# Altium schematic sheet 02. ZIGBEE CC2530.SchDoc
size A4
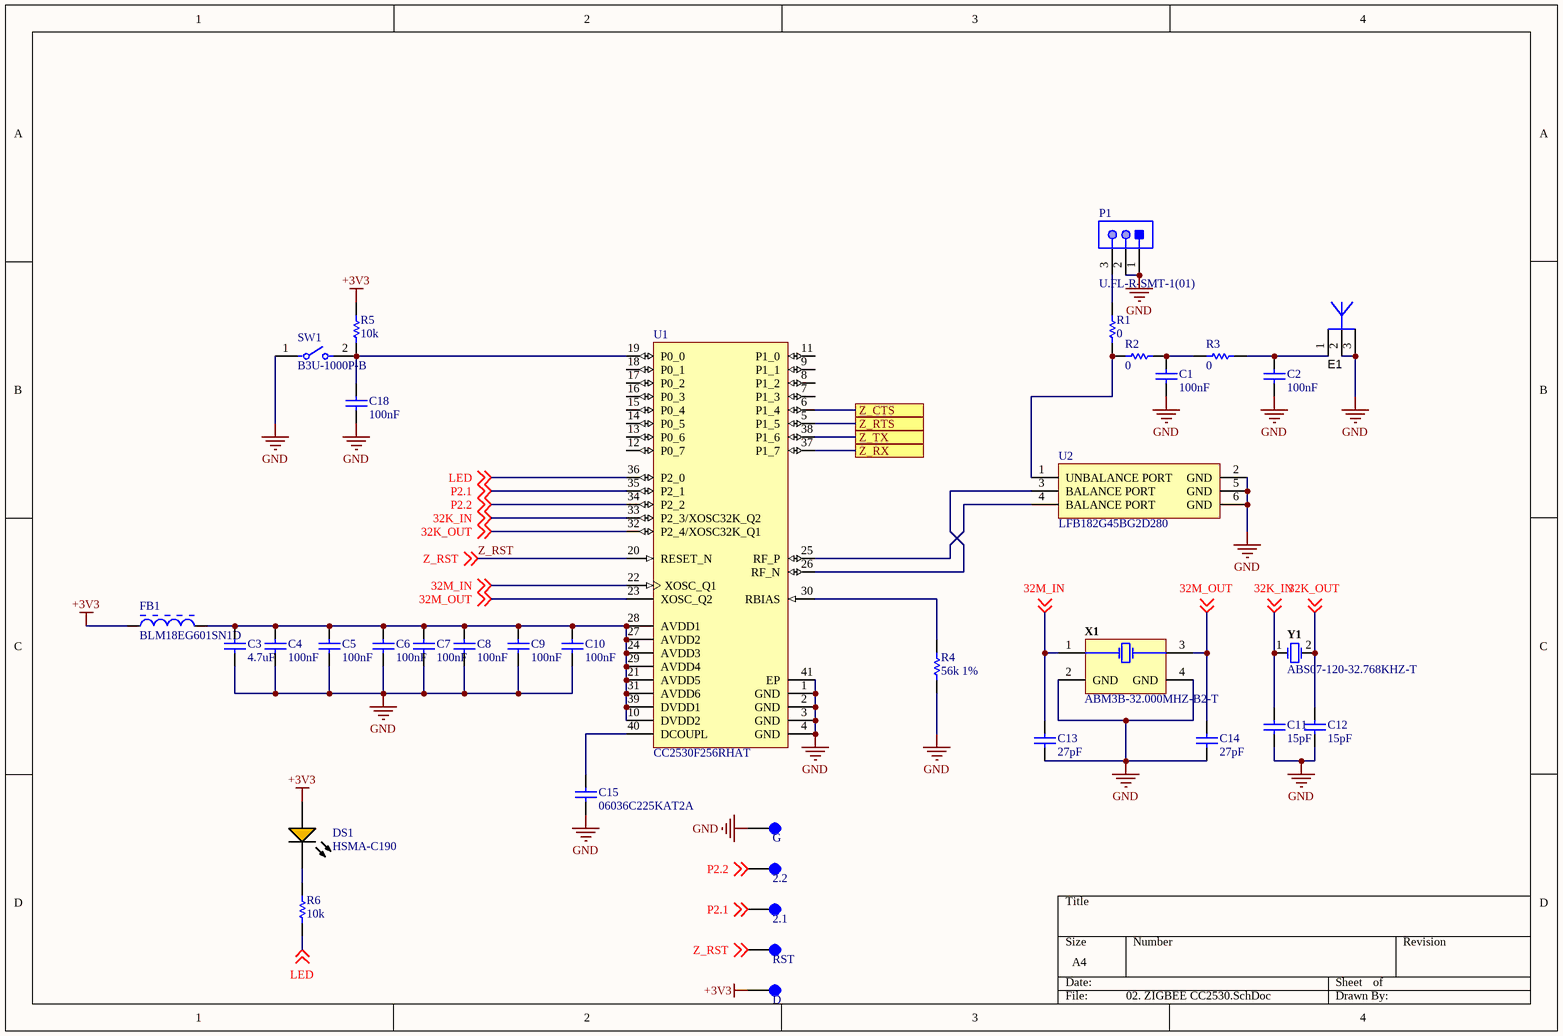
[diagram p0: 02. ZIGBEE CC2530.SchDoc]

## Parts
2.1  Test Point  [TP]  (value not drawn)
2.2  Test Point  [TP]  (value not drawn)
C1  100nF  [CAPC1005X56X25NL10T15]
C2  100nF  [CAPC1005X56X25NL10T15]
C3  4.7uF  [CAPC1608X90X35NL10T15]
C4  100nF  [CAPC1005X56X25NL10T15]
C5  100nF  [CAPC1005X56X25NL10T15]
C6  100nF  [CAPC1005X56X25NL10T15]
C7  100nF  [CAPC1005X56X25NL10T15]
C8  100nF  [CAPC1005X56X25NL10T15]
C9  100nF  [CAPC1005X56X25NL10T15]
C10  100nF  [CAPC1005X56X25NL10T15]
C11  15pF  [CAPC1005X56X25NL10T15]
C12  15pF  [CAPC1005X56X25NL10T15]
C13  27pF  [CAPC1005X56X25NL10T15]
C14  27pF  [CAPC1005X56X25NL10T15]
C15  06036C225KAT2A  [CAPC1608X90X35NL15T15]
C18  100nF  [CAPC1005X56X25NL10T15]
D  Test Point  [TP]  (value not drawn)
DS1  HSMA-C190  [AVAG-HSMX-C190_V]
E1  ANTENNA_DN007A  [2.4Ghz TI ANTENNA_DN007A]  (value not drawn)  (net tie)
FB1  BLM18EG601SN1D  [MURA-BLM18-F-H1-CHIP-2_V]
G  Test Point  [TP]  (value not drawn)
P1  U.FL-R-SMT-1(01)  [HRS-U.FL-R-SMT-3_V]
R1  0  [RESC1005X40X25NL05T05]
R2  0  [RESC1005X40X25NL05T05]
R3  0  [RESC1005X40X25NL05T05]
R4  56k 1%  [RESC1609X50X30NL10T20]
R5  10k  [RESC1005X40X25NL05T05]
R6  10k  [RESC1005X40X25NL05T05]
RST  Test Point  [TP]  (value not drawn)
SW1  B3U-1000P-B  [FP-B3U-1000P-B-MFG]
U1  CC2530F256RHAT  [RHA0040H_V]
U2  LFB182G45BG2D280  [MURA-LFB182G45BG5D920-6_V]
X1  ABM3B-32.000MHZ-B2-T  [ABRA-ABM3B_V]
Y1  ABS07-120-32.768KHZ-T  [ABRA-ABS07_A_V]

## Ports
Z_CTS, Z_RTS, Z_RX, Z_TX

## Nets
+3V3: D.1 DS1.1(A) FB1.1 R5.2
GND: C1.1 C2.1 C3.1 C4.1 C5.1 C6.1 C7.1 C8.1 C9.1 C10.1 C11.2 C12.2 C13.1 C14.1 C15.1 C18.1 E1.2 E1.3 G.1 P1.1 P1.2 R4.1 SW1.1 U1.1(GND) U1.2(GND) U1.3(GND) U1.4(GND) U1.41(EP) U2.2(GND) U2.5(GND) U2.6(GND) X1.2(GND) X1.4(GND)
32K_IN: C11.1 U1.33(P2_3/XOSC32K_Q2) Y1.1 ; off-sheet 32K_IN
32K_OUT: C12.1 U1.32(P2_4/XOSC32K_Q1) Y1.2 ; off-sheet 32K_OUT
32M_IN: C13.2 U1.22(XOSC_Q1) X1.1(X1) ; off-sheet 32M_IN
32M_OUT: C14.2 U1.23(XOSC_Q2) X1.3(X2) ; off-sheet 32M_OUT
LED: R6.1 U1.36(P2_0) ; off-sheet LED
P2.1: 2.1.1 U1.35(P2_1) ; off-sheet P2.1
P2.2: 2.2.1 U1.34(P2_2) ; off-sheet P2.2
Z_CTS: U1.6(P1_4) ; port Z_CTS
Z_RST: RST.1 U1.20(RESET_N) ; off-sheet Z_RST
Z_RTS: U1.5(P1_5) ; port Z_RTS
Z_RX: U1.37(P1_7) ; port Z_RX
Z_TX: U1.38(P1_6) ; port Z_TX
NetC1_2: C1.2 R2.1 R3.2
NetC2_2: C2.2 E1.1 R3.1
NetC3_2: C3.2 C4.2 C5.2 C6.2 C7.2 C8.2 C9.2 C10.2 FB1.2 U1.10(DVDD2) U1.21(AVDD5) U1.24(AVDD3) U1.27(AVDD2) U1.28(AVDD1) U1.29(AVDD4) U1.31(AVDD6) U1.39(DVDD1)
NetC15_2: C15.2 U1.40(DCOUPL)
NetC18_2: C18.2 R5.1 SW1.2 U1.19(P0_0)
NetDS1_2: DS1.2(K) R6.2
NetP1_3: P1.3 R1.1
NetR1_2: R1.2 R2.2 U2.1(UNBALANCE_PORT)
NetR4_2: R4.2 U1.30(RBIAS)
NetU1_25: U1.25(RF_P) U2.4(BALANCE_PORT)
NetU1_26: U1.26(RF_N) U2.3(BALANCE_PORT)

Not connected (* = marked no-connect by the designer): U1 7(P1_3) 8(P1_2) 9(P1_1) 11(P1_0) 12(P0_7) 13(P0_6) 14(P0_5) 15(P0_4) 16(P0_3) 17(P0_2) 18(P0_1)

## Library data of the parts
2.1 2.2 D G RST = TP
C1 C2 C4-C10 C18 = CMP-2008-02743-1: Manufacturer: AVX Interconnect / Elco; Part Number: 04026D104KAT2A
C3 = CMP-2006-02545-1: Part Number: GRM188R6YA475KE15D; Manufacturer: Murata
C11-C14 = CMP-2008-02620-1: Part Number: 04025A270FAT2A; Manufacturer: AVX Interconnect / Elco
C15 = CMP-2006-04473-1: Manufacturer: AVX Interconnect / Elco; Part Number: 06036C225KAT2A
DS1 = CMP-1744-00005-1: LED Uni-Color Amber, 60 mW, 20 mA, -40 to 85 degC, 2-Pin SMD, RoHS, Tape and Reel; Resistance: 70000 Ohm; ESR: 70 kohm; Frequency: 32.768 KHz; Tolerance: 20ppm; Load Capacitance: 12.5 pF; Capacitance: 1.25E-11 f; Length: 0.126 inch; ComponentLink1Description: Manufacturer URL; Min Operating Temperature: -40degC; RoHSCompliant: True; ComponentLink1URL: http://www.avagotech.com/; Packaging: Tape and Reel; PackageDescription: 2-Pin Surface Mount Device, Body 1.6 x 0.8 mm, Height 0.9 mm; ComponentLink3Description: Package Specification; Width: 0.059 inch; Mount: Surface Mount; REACH SVHC: No SVHC; ComponentLink2URL: http://docs.avagotech.com/docs/AV02-0112EN; Height: 0.033 inch; ComponentLink2Description: Datasheet; Pins: 2; Frequency Tolerance: 20ppm; Max Operating Temperature: 85degC; ComponentLink3URL: http://www.fairchildsemi.com/dwg/MA/MA03D.pdf; PackageReference: HSMX-C190; Package Quantity: 1; DatasheetVersion: Sep-10
E1 = ANTENNA_DN007A: 2.4GHz PCB Antenna.  There is nothing to buy or mount.; SymbolCreator: a0412235; SymbolVersion: 2014-08-14; PartNumber: ANTENNA_DN007A; Manufacturer: N/A; CompType: Antenna; MountType: N/A; ComponentLink1Description: Datasheet Link; ComponentLink1URL: https://sps06.itg.ti.com/sites/KMS/crossdivteams/altium/docs/ComponentDatasheets/CC26xxEM-7IB_1_0_Layout.pdf; PackageReference: SMD, 3-Leads; Publisher: Texas Instruments; LatestRevisionDate: 2015-12-09
FB1 = CMP-0686-00354-2: Chip Ferrite Bead for GHz Band General Use (Low DC Resistance Type), 600 Ohm, 500 mA, -55 to 125 degC, 1.6 x 0.8 x 0.95 mm SMD, Tape and Reel; Manufacturer: Murata; Rated Current: 500 mA; DC Resistance: 0.35 Ohm Max.; Impedance (at 100 MHz): 600 Ohm +/- 25%; Packing: Tape and Reel; ComponentLink2URL: http://www.murata.com/products/catalog/pdf/c31e.pdf; PartNumber: BLM18EG601SN1D; Mounting Technology: Surface Mount; Operating Temperature Range: -55 to 125 degC; ComponentLink3URL: http://www.murata.com/products/catalog/pdf/c31e.pdf; ComponentLink2Description: Datasheet; ComponentLink1Description: Manufacturer URL; DatasheetVersion: 08/2013; ComponentLink1URL: http://www.murata.com/; PackageReference: BLM18_H950-2; ComponentLink3Description: Package Specification; PackageDescription: 2-Pin Chip, Body 1.6 x 0.8 mm
P1 = CMP-2000-05153-1: Ultra Small Coaxial Connector, 6 GHz, -40 to 90 degC, 3-Pin SMD, RoHS, Bulk; Manufacturer: Hirose Electric; Connector Style: U.FL; Impedance: 50Ohm; Dielectric Material: LiquidCrystalPolymer(LCP); Minimum Quantity: UltraMiniatureCoaxial; Online Catalog: U.FLSeries; Featured Product: HiroseU.FLSeries; Frequency - Max: 6GHz; Other Names: H122041 / U.FL-R-SMT-1(01)-ND; Contact Termination: Solder; Body Material: PhosphorBronze; Connector Type: Jack,MalePin; Body Finish: Silver; Center Contact Plating: Gold; Manufacturer URL: https://www.hirose.com; Family: CoaxialConnectors(RF); Fastening Type: Snap-On; Unit PriceUSD: U.FL; Series: U.FL; Package Reference: U.FL-R-SMT; Packaging: Bulk; Standard Package: 100; Mounting Type: SurfaceMount; Quantity Available: Bulk; Housing Color: Silver; Package Description: 3-Pin Surface Mount Device, Body 2.6 x 2.6 mm; Category: Connectors,Interconnects; Operating Temperature: -40degC~90degC; Center Contact Material: PhosphorBronze; Dynamic Catalog: U.FLSeries; Datasheet URL: https://datasheet.ciiva.com/26945/getdatasheetpartid-475239-26945414.pdf; Datasheet Version: Feb-09; Shield Termination: Solder
R1-R3 R5 R6 = CMP-2000-07588-1: Chip Resistor, 10 KOhm, +/- 1%, 0.1 W, -55 to 155 degC, 0402 (1005 Metric), RoHS, Tape and Reel; Manufacturer: Panasonic; Power Rating: 100mW; Voltage Rating: 50V; Resistance: 10KOhm; Case\/Package: 0402; Temperature Coefficient: 100ppm\/degreesC; RoHSCompliant: True; Lead Free: LeadFree; Package Quantity: 1; Contact Plating: Tin; Length: 1mm; Radiation Hardening: No; REACH SVHC: NoSVHC; Max Operating Temperature: 155degC; Depth: 0.5mm; Case Code (Imperial): 0402; Military Standard: Not; Package Description: 2-Pin Surface Mount Device, Body 1 x 0.5 mm; Termination: SMD/SMT; Case Code (Metric): 1005; Height: 0.35mm; Packaging: TapeandReel; Voltage Rating (DC): 50V; Package Reference: 402; Number of Pins: 2; Tolerance: 1%; Mounting Technology: SurfaceMount; Width: 0.02inch; Mount: SurfaceMount; Datasheet URL: https://industrial.panasonic.com/cdbs/www-data/pdf/RDA0000/AOA0000C304.pdf; Composition: ThickFilm; Datasheet Version: 02/2017; Manufacturer URL: http://www.panasonic.com/; Max Power Dissipation: 100mW; Number of Terminations: 2; Min Operating Temperature: -55degC
R4 = CMP-2000-03467-1: Part Number: CRCW060356K0FKEA; Manufacturer: Vishay Dale
SW1 = CMP-08834-000005-1: SWITCH TACTILE SPST-NO 0.05A 12V; Manufacturer: Omron; Operating Force: 1.5N; Contact Current Rating: 50mA; Contact Resistance: 100mΩ; Electromechanical Life: 200000Cycles; Height: 1.75mm; Device Class L2: Switches; Temperature Range High: +70°C; Digikey Description: SWITCH TACTILE SPST-NO 0.05A 12V; Throw Configuration: SPST-NO; Ambient Temperature Range High: +70°C; Temperature: -25°C to +70°C; Lead Free: Yes; ComponentLink2URL: https://omronfs.omron.com/en_US/ecb/products/pdf/en-b3u.pdf; Device Class L3: Tactile Switches; Manufacturer Part Number: B3U-1000P-B; Ambient Temperature Range Low: -25°C; Mount: Surface Mount; Automotive: No; Mouser Description: Tactile Switches Top Actuated with boss w/o ground; Octopart: https://octopart.com/b3u-1000p-b-omron-1057356; RoHS: TRUE; Package: 0; Device Class L1: Electromechanical; Voltage Rating Dc: 12V; Category: Switch; Temperature Range Low: -25°C; ComponentLink2Description: Datasheet
U1 = CMP-0458-00002-3: CC2530 System-on-Chip Solution for 2.4-GHz IEEE 802.15.4 and ZigBee Applications; Manufacturer: Texas Instruments; Frequency Range: 2.4GHz; Data Rate (Max) (kbps): 250; Pin/Package: 40VQFN; Modulation Techniques: DSSS; Standby Current (uA): 0.4; Antenna Connection: Differential; Flash size (KB): 256; Operating Voltage (Min) (V): 2; RAM Size (KB): 8; Sensitivity (Best) (dBm): -97; RX Current (Lowest) (mA): 20.5; TX Power (dBm): 4.5; Operating Voltage (Max) (V): 3.6; Wakeup Time (PD-->RX/TX) (us): 600; ComponentLink3URL: http://www.ti.com/lit/ml/mpqf135c/mpqf135c.pdf; ComponentLink1URL: http://www.ti.com/; Device Type: System-on-Chip; ComponentLink2URL: http://www.ti.com/lit/ds/symlink/cc2530.pdf; ComponentLink2Description: Datasheet; ComponentLink1Description: Manufacturer URL; Mounting Technology: Surface Mount; PartNumber: CC2530F256RHAT; DatasheetVersion: SWRS081B; ComponentLink3Description: Package Specification; PackageVersion: 4204276/E; PackageDescription: 40-Pin Quad Flat No-Lead Package, Body 6 x 6mm, Pitch 0.5mm; PackageReference: RHA0040H
U2 = CMP-2000-06539-1: Balance Matching Band Pass Filter, -40 to 85 degC, 6-Pin SMD, RoHS, Tape and Reel; Manufacturer: Murata; Insertion Loss: 0.75dB; Bandwidth: 2.45GHz; Frequency Range: 2.4GHzto2.5GHz; Impedance: 50Ohms; Brand: MurataElectronics; Frequency: 2.4GHz; Product: BandPassFilters; Mounting Technology: SurfaceMount; Product Category: SignalConditioning; RoHS: Details; Packaging: Reel; Operating Temperature Range: -40Cto+85C; Series: LFB; Package Reference: LFB182G45BG2D280; Datasheet Version: 01/2016; Package / Case: 0603(1608metric); Manufacturer URL: http://www.murata.com/; PartNumber: LFB182G45BG2D280; Datasheet URL: http://www.murata.com/~/media/webrenewal/products/balun/balun/forconnectivity/lfb182g45bg2d280.ashx?la=en; Factory Pack Quantity: 4000; Package Description: 6-Pin Chip Array, Body 1.6 x 0.8 mm, Pitch 0.5 mm; Type: BandPassFilter; Termination Style: SMD/SMT
X1 = CMP-1688-00002-1: Ceramic SMD Crystal, 8 MHz, +/- 20 ppm, 200 Ohm, -20 to 70 degC, 4-Pin SMD, RoHS, Tape and Reel; Max Supply Voltage: 45 V; Outputs: 4; Min Supply Voltage: 8.2 V; Output Voltage: 3.3 V; Switching Frequency: 30 KHz; Output Current: 1.8 A; Packaging: Rail/Tube; ComponentLink2Description: Datasheet; REACH SVHC: No SVHC; ComponentLink1URL: http://www.abracon.com/; PackageReference: ABM3B; Weight: 0.004233 oz; Height: 1.05 mm; ComponentLink2URL: http://www.abracon.com/Resonators/abm3b.pdf; Mount: Surface Mount; Min Operating Temperature: -40 degC; Max Operating Temperature: 85 degC; Package Quantity: 50; PackageDescription: 4-Pin Surface Mount Device, Body 5 x 3.2 mm; Pins: 28; DatasheetVersion: Aug-15; ComponentLink1Description: Manufacturer URL; RoHSCompliant: true; Radiation Hardening: No; Length: 9.8 mm; Width: 4.5 mm
Y1 = CMP-2000-07587-1: Tuning Fork Crystal, 32.768 KHz, +/- 20 ppm, -40 to 85 degC, 2-Pin SMD, RoHS, Tape and Reel; Manufacturer: Abracon; Case\/Package: SMD/SMT; Series Resistance: 60KOhm; Frequency Tolerance: 20ppm; Load Capacitance: 6pF; ESR (Equivalent Series Resistance): 55KOhm; Max Operating Temperature: 85degC; Width: 0.061inch; Radiation Hardening: No; Lead Free: LeadFree; RoHSCompliant: True; Depth: 1.5mm; Datasheet URL: http://www.abracon.com/Resonators/ABS07-120-32.768kHz-T.pdf; Frequency: 32.768KHz; Termination: SMD/SMT; Manufacturer URL: http://www.abracon.com/; Package Quantity: 3000; Packaging: TapeandReel; Number of Pins: 2; Height: 0.035inch; Package Description: 2-Pin Surface Mount Device, Body 3.2 x 1.5 mm; Package Reference: ABS07; Mount: SurfaceMount; Tolerance: 20ppm; Mounting Technology: SurfaceMount; REACH SVHC: NoSVHC; Datasheet Version: 11/2014; Length: 3.2mm; Min Operating Temperature: -40degC